# Altium project MISKO3.PrjPcb (part 2 of 2)
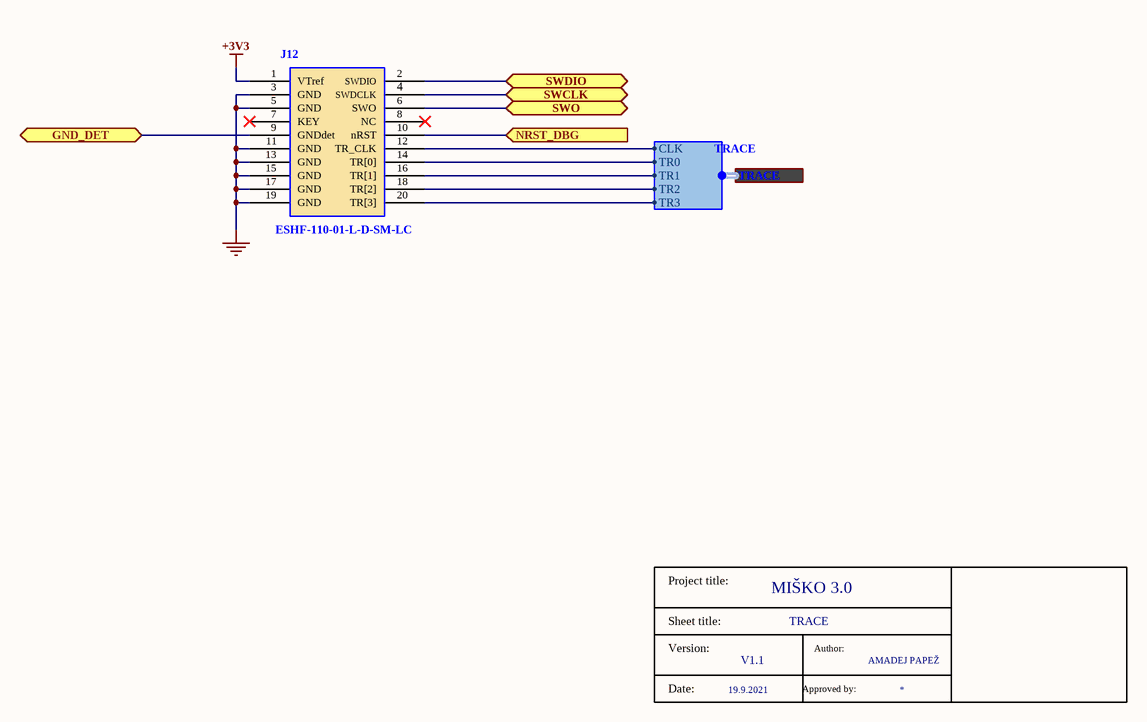
[diagram p13: Trace.SchDoc]

## Nets that join several sheets
+3V3: ARDUINO_GPIO (J9.2 J9.4), POWER (U2.6 U2.8), JOYSTICK + LED (C39.2 J11.5), CAN + LIN (6 pins), STLINK_2.1 (16 pins), MCU (18 pins), QSPI (IC1.8 R95.1), LCD + TOUCH  (11 pins), Trace (J12.1)
+3V3HUB: POWER (8 pins), USB_HUB (9 pins)
+5: ARDUINO_GPIO (J5.1 J5.2 J9.5), POWER (C4.2 C5.2 FB1.2 U1.3), USB_HUB (R14.2), CAN + LIN (C38.2 D3.2 U8.3), STLINK_2.1 (R32.1), LCD + TOUCH  (U6.16)
+12: ARDUINO_GPIO (J9.8), CAN + LIN (D4.2)
AREF: ARDUINO_GPIO (J7.8), MCU (8 pins)
GND: BUTTONS (21 pins), ARDUINO_GPIO (5 pins), POWER (11 pins), USB_HUB (14 pins), JOYSTICK + LED (17 pins), CAN + LIN (10 pins), STLINK_2.1 (27 pins), MCU (20 pins), USB_C (14 pins), QSPI (IC1.4 R94.2), LCD + TOUCH  (14 pins), Trace (7 pins)
AD0: ARDUINO_GPIO (J8.1), MCU (U9.27)
AD1: ARDUINO_GPIO (J8.2), MCU (U9.28)
AD2: ARDUINO_GPIO (J8.3), MCU (U9.29)
AD3: ARDUINO_GPIO (J8.4), MCU (U9.32)
AD4: ARDUINO_GPIO (J8.5), MCU (U9.37)
AD5: ARDUINO_GPIO (J8.6), MCU (U9.20)
AD6: ARDUINO_GPIO (J8.7), MCU (U9.38)
AD7: ARDUINO_GPIO (J8.8), MCU (U9.41)
AD8: ARDUINO_GPIO (J10.1), MCU (U9.34)
AD9: ARDUINO_GPIO (J10.2), MCU (U9.73)
AD10: ARDUINO_GPIO (J10.3), MCU (U9.74)
AD11: ARDUINO_GPIO (J10.4), MCU (U9.75)
ARDUINO_CS: ARDUINO_GPIO (J5.21), MCU (U9.48)
BC_EN1: POWER (U2.1), USB_HUB (R15.1 U3.7)
CAN2_RX: CAN + LIN (R62.2 U8.4), MCU (U9.66)
CAN2_TX: CAN + LIN (R63.2 U8.1), MCU (U9.67)
CAN_STBY: CAN + LIN (R66.1 U8.8), MCU (U9.105)
CANH: ARDUINO_GPIO (J10.8), CAN + LIN (D7.1 R64.1 U8.7)
CANL: ARDUINO_GPIO (J10.7), CAN + LIN (D7.2 R65.1 U8.6)
CUR_LIMIT: POWER (LED2.1 U2.2), USB_HUB (U3.8)
DAC1: ARDUINO_GPIO (J10.5), MCU (U9.33)
DAC2: ARDUINO_GPIO (J10.6), MCU (U9.35)
FLASH_CS: ARDUINO_GPIO (J5.26), MCU (U9.120)
FMC_D0: ARDUINO_GPIO (J5.18), MCU (U9.76), LCD + TOUCH  (U6.23)
FMC_D1: ARDUINO_GPIO (J5.17), MCU (U9.77), LCD + TOUCH  (U6.24)
FMC_D2: ARDUINO_GPIO (J5.16), MCU (U9.108), LCD + TOUCH  (U6.25)
FMC_D3: ARDUINO_GPIO (J5.15), MCU (U9.109), LCD + TOUCH  (U6.26)
FMC_D4: ARDUINO_GPIO (J5.14), MCU (U9.53), LCD + TOUCH  (U6.27)
FMC_D5: ARDUINO_GPIO (J5.13), MCU (U9.54), LCD + TOUCH  (U6.28)
FMC_D6: ARDUINO_GPIO (J5.12), MCU (U9.55), LCD + TOUCH  (U6.29)
FMC_D7: ARDUINO_GPIO (J5.11), MCU (U9.56), LCD + TOUCH  (U6.30)
FMC_D8: ARDUINO_GPIO (J5.3), MCU (U9.57), LCD + TOUCH  (U6.1)
FMC_D9: ARDUINO_GPIO (J5.4), MCU (U9.58), LCD + TOUCH  (U6.2)
FMC_D10: ARDUINO_GPIO (J5.5), MCU (U9.59), LCD + TOUCH  (U6.3)
FMC_D11: ARDUINO_GPIO (J5.6), MCU (U9.60), LCD + TOUCH  (U6.4)
FMC_D12: ARDUINO_GPIO (J5.7), MCU (U9.61), LCD + TOUCH  (U6.22)
FMC_D13: ARDUINO_GPIO (J5.8), MCU (U9.70), LCD + TOUCH  (U6.35)
FMC_D14: ARDUINO_GPIO (J5.9), MCU (U9.71), LCD + TOUCH  (U6.36)
FMC_D15: ARDUINO_GPIO (J5.10), MCU (U9.72), LCD + TOUCH  (U6.37)
I2C1_SCL: ARDUINO_GPIO (J7.10), MCU (U9.99)
I2C1_SDA: ARDUINO_GPIO (J7.9), MCU (U9.122)
I2C2_SCL: ARDUINO_GPIO (J4.1), MCU (U9.90)
I2C2_SDA: ARDUINO_GPIO (J4.2), MCU (U9.89)
JOY_BTN: JOYSTICK + LED (C41.2 R68.1), MCU (U9.7)
JOY_X: JOYSTICK + LED (C42.2 R69.1), MCU (U9.68)
JOY_Y: JOYSTICK + LED (C40.2 R67.1), MCU (U9.69)
LCD_BKLT: ARDUINO_GPIO (J5.29), MCU (U9.121), LCD + TOUCH  (M1.G)
LCD_CS: MCU (U9.117), LCD + TOUCH  (U6.7)
LCD_RD: ARDUINO_GPIO (J5.24), MCU (U9.114), LCD + TOUCH  (U6.10)
LCD_RS: ARDUINO_GPIO (J5.19), MCU (U9.103), LCD + TOUCH  (U6.8)
LCD_RST: ARDUINO_GPIO (J5.22), MCU (U9.113), LCD + TOUCH  (U6.31)
LCD_WR: ARDUINO_GPIO (J5.20), MCU (U9.115), LCD + TOUCH  (U6.9)
LIN_BUS: ARDUINO_GPIO (J5.23), CAN + LIN (C37.1 D6.2 R60.2 U7.6)
LIN_SLP: CAN + LIN (R58.2 R61.2 U7.2), MCU (U9.125)
MCI: STLINK_2.1 (C22.2 R42.1), MCU (U9.19)
MISO: ARDUINO_GPIO (J5.31), MCU (U9.85), LCD + TOUCH  (U5.12)
MOSI: ARDUINO_GPIO (J5.32), MCU (U9.86), LCD + TOUCH  (U5.14)
NetC43_2: BUTTONS (C43.2 R86.1), MCU (U9.82)
NetC44_2: BUTTONS (C44.2 R87.1), MCU (U9.83)
NetC45_2: BUTTONS (C45.2 R88.1), MCU (U9.104)
NetC47_2: BUTTONS (C47.2 R90.1), MCU (U9.106)
NetC48_2: BUTTONS (C48.2 R91.1), MCU (U9.9)
NetC49_2: BUTTONS (C49.2 R92.1), MCU (U9.8)
NetIC1_1: MCU (U9.65), QSPI (IC1.1 R94.1)
NetIC1_6: MCU (U9.62), QSPI (IC1.6)
NetJ12_12: MCU (U9.1), Trace (J12.12)
NetJ12_14: MCU (U9.2), Trace (J12.14)
NetJ12_16: MCU (U9.3), Trace (J12.16)
NetJ12_18: MCU (U9.4), Trace (J12.18)
NetJ12_20: MCU (U9.5), Trace (J12.20)
NRST: BUTTONS (C46.2 R89.1), ARDUINO_GPIO (J9.3), STLINK_2.1 (5 pins), MCU (C50.2 R93.2 U9.21), Trace (J12.10)
PWM2: ARDUINO_GPIO (J6.3), MCU (U9.15)
PWM3: ARDUINO_GPIO (J6.4), MCU (U9.16)
PWM4: ARDUINO_GPIO (J6.5), MCU (U9.17)
PWM5: ARDUINO_GPIO (J6.6), MCU (U9.18)
PWM6: ARDUINO_GPIO (J6.7), MCU (U9.49)
PWM7: ARDUINO_GPIO (J6.8), MCU (U9.50)
PWM8: ARDUINO_GPIO (J7.1), MCU (U9.51)
PWM9: ARDUINO_GPIO (J7.2), MCU (U9.52)
PWM10: ARDUINO_GPIO (J7.3), MCU (U9.80)
PWM11: ARDUINO_GPIO (J7.4), MCU (U9.81)
PWM12: ARDUINO_GPIO (J7.5), MCU (U9.87)
PWM13: ARDUINO_GPIO (J7.6), MCU (U9.88)
QSPI_IO0: ARDUINO_GPIO (J5.27), MCU (U9.40), QSPI (IC1.5)
QSPI_IO1: ARDUINO_GPIO (J5.28), MCU (U9.39), QSPI (IC1.2)
QSPI_IO2: ARDUINO_GPIO (J5.30), MCU (U9.36), QSPI (IC1.3)
QSPI_IO3: MCU (U9.97), QSPI (IC1.7 R95.2)
SCK: ARDUINO_GPIO (J5.33), MCU (U9.84), LCD + TOUCH  (U5.16)
STM_JRST: STLINK_2.1 (C23.2 J3.2 R41.2 U4.7), Trace (J12.9)
T_JTCK: STLINK_2.1 (5 pins), MCU (U9.98), Trace (J12.4)
T_JTMS: STLINK_2.1 (5 pins), MCU (U9.96), Trace (J12.2)
T_SWO: ARDUINO_GPIO (J4.4), STLINK_2.1 (R33.2 SB4.1 SB4.2 U4.31), MCU (U9.118), Trace (J12.6)
TCH_CS: ARDUINO_GPIO (J5.34), MCU (U9.126), LCD + TOUCH  (U5.15)
TCH_PENIRQ: ARDUINO_GPIO (J5.25), MCU (U9.116), LCD + TOUCH  (U5.11)
UART4_RX: ARDUINO_GPIO (J4.5), MCU (U9.101)
UART4_TX: ARDUINO_GPIO (J4.6), MCU (U9.100)
USART1_RX: ARDUINO_GPIO (J6.1), MCU (U9.91)
USART1_TX: ARDUINO_GPIO (J6.2), MCU (U9.107)
USART2_RX: ARDUINO_GPIO (J4.3), MCU (U9.119)
USART3_RX: STLINK_2.1 (U4.12), MCU (U9.123)
USART3_TX: STLINK_2.1 (U4.13), MCU (U9.124)
USART5_RX: ARDUINO_GPIO (J4.7), CAN + LIN (R59.2 U7.1), MCU (U9.112)
USART5_TX: ARDUINO_GPIO (J4.8), CAN + LIN (R57.2 U7.4), MCU (U9.102)
USB2_N: USB_HUB (U3.4), MCU (U9.92)
USB2_P: USB_HUB (U3.5), MCU (U9.93)
USB_N: USB_HUB (U3.19), USB_C (D1.6 J1.A7 J1.B7)
USB_P: USB_HUB (U3.20), USB_C (D1.4 J1.A6 J1.B6)
USB_STLINK_N: USB_HUB (U3.2), STLINK_2.1 (U4.32)
USB_STLINK_P: USB_HUB (U3.3), STLINK_2.1 (R38.1 U4.33)
V_BUS: POWER (FB1.1), USB_C (7 pins)